# Altium schematic sheet power.SchDoc
size A4; SheetNumber: 2; SheetTotal: 2
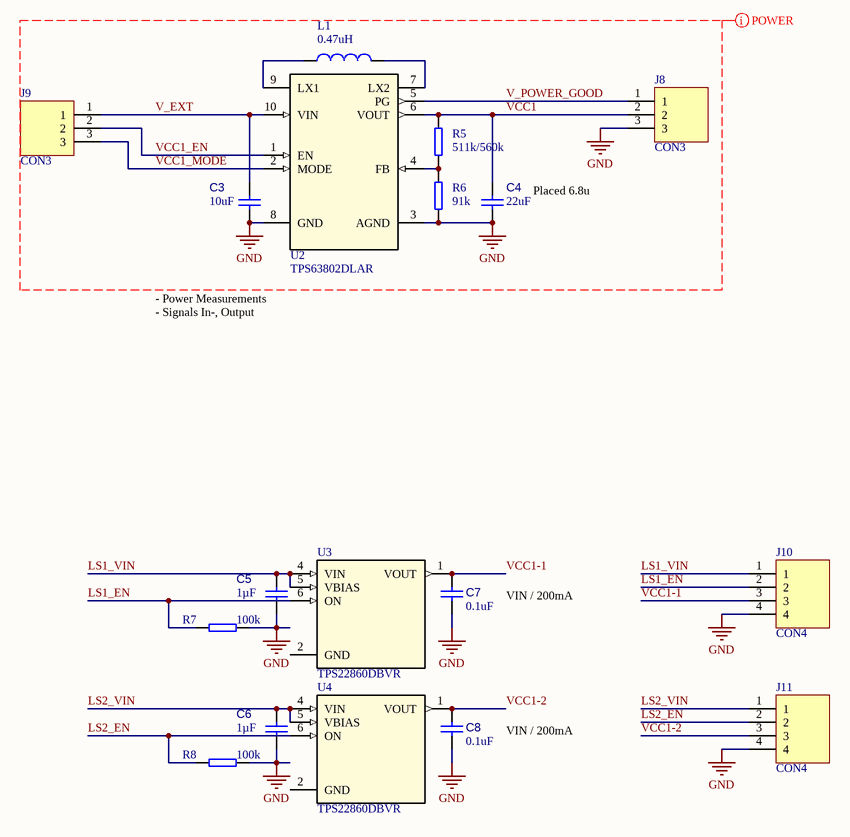
[diagram p0: power.SchDoc]

## Parts
C3  value 10uF  [0805_S]  (hidden comment: Capacitor 0402)
C4  value 22uF  [0805_S]  (hidden comment: Capacitor 0402)
C5  value 1µF  [0603]  (hidden comment: Capacitor 0402)
C6  value 1µF  [0603]  (hidden comment: Capacitor 0402)
C7  value 0.1uF  [0603]  (hidden comment: Capacitor 0402)
C8  value 0.1uF  [0603]  (hidden comment: Capacitor 0402)
J8  CON3  [HEADER_3_RM_2.54]
J9  CON3  [HEADER_3_RM_2.54]
J10  CON4  [HEADER_4_RM_2.54]
J11  CON4  [HEADER_4_RM_2.54]
L1  0.47uH  [1210]
R5  511k/560k  [0805_S]
R6  91k  [0805_S]
R7  100k  [0805]
R8  100k  [0805]
U2  TPS63802DLAR  [VREG_TPS63802DLAR]
U3  TPS22860DBVR  [SOT95P280X145-6N]
U4  TPS22860DBVR  [SOT95P280X145-6N]

## Nets
GND: C3.1 C4.1 C5.1 C6.1 C7.1 C8.1 J8.3 J10.4 J11.4 R6.2 R7.2 R8.2 U2.3(AGND) U2.8(GND)
LS1_EN: J10.2 R7.1 U3.6(ON)
LS1_VIN: C5.2 J10.1 U3.4(VIN) U3.5(VBIAS)
LS2_EN: J11.2 R8.1 U4.6(ON)
LS2_VIN: C6.2 J11.1 U4.4(VIN) U4.5(VBIAS)
V_EXT: C3.2 J9.1 U2.10(VIN)
V_POWER_GOOD: J8.1 U2.5(PG)
VCC1: C4.2 J8.2 R5.1 U2.6(VOUT)
VCC1-1: C7.2 J10.3 U3.1(VOUT)
VCC1-2: C8.2 J11.3 U4.1(VOUT)
VCC1_EN: J9.2 U2.1(EN)
VCC1_MODE: J9.3 U2.2(MODE)
NetL1_1: L1.1 U2.9(LX1)
NetL1_2: L1.2 U2.7(LX2)
NetR5_2: R5.2 R6.1 U2.4(FB)

Not connected (* = marked no-connect by the designer): U3 2(GND); U4 2(GND)

## Layout directives
net class POWER: GND, V_EXT, V_POWER_GOOD, VCC1, VCC1_EN, VCC1_MODE

## Notes on the sheet
- (near C4) Placed 6.8u
- - Power Measurements
  - Signals In-, Output
- VIN / 200mA

## Library data of the parts
C3-C8 = C: Manufacturer: TDK; Manufacturer Part Number: C1005X6S0J105K050BC; Manufacturer: Murata; Manufacturer Part Number: GRM155R60J105KE19D; Manufacturer: Kyocera AVX; Manufacturer Part Number: 04026D105KAT2A; Voltage Rating: 6.3V; Capacitor Type: Ceramic; Tolerance: 10%; Mounting Technology: SM; Min Operating Temperature: -55°C; Pins: 2; Case/Package: 0402; RoHS Compliant: True; Max Operating Temperature: 85°C; Component Type: Capacitors
L1 = L?: Supplier: Mouser; Supplier Part Number: 81-1276AS-H-R47MP2; Supplier 1: Mouser; Supplier Part Number 1: 81-1276AS-H-R47MP2
R5-R8 = R?: Normaler Widerstand
  R6: Supplier: Mouser; Supplier Part Number: 595-TPS63802DLAR
U2 = TPS63802DLAR: MF: Richtek USA; MP: RT6150B-33GQW; SnapEDA_Link: https://www.snapeda.com/parts/RT6150B-33GQW/Richtek+USA+Inc./view-part/?ref=snap; Package: WFDFN-10 Richtek; Value: *; Check_prices: https://www.snapeda.com/parts/RT6150B-33GQW/Richtek+USA+Inc./view-part/?ref=eda
U3 U4 = TPS22860DBVR: 0.73-?, 5-V, ultra-low leakage load switch 6-SOT-23 -40 to 85; MF: Texas Instruments; MP: TPS22860DBVR; SnapEDA_Link: https://www.snapeda.com/parts/TPS22860DBVR/Texas%20Instruments/view-part/473340/?ref=snap; Texas_Instruments-Purchase-URL: https://snapeda.com/shop?store=Texas+Instruments&id=473340; Value: *; Package: SOT-23-6 Texas Instruments; Digi-Key_Part_Number: 296-43982-1-ND